# EAGLE design pic_board (EAGLE 6.1)
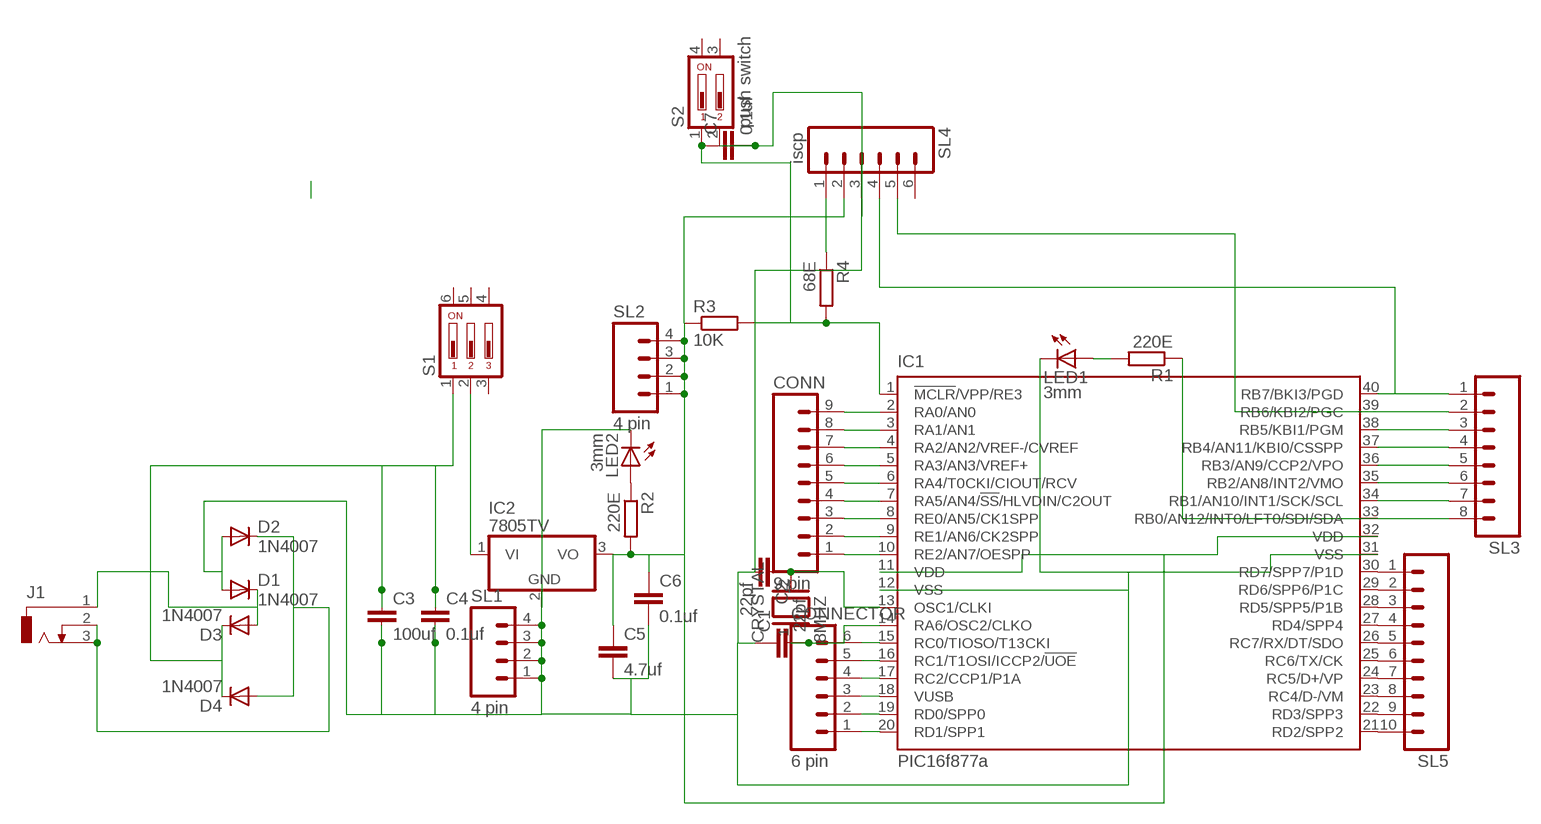
[diagram p0: schematic, sheet 1]

## Parts
C1  22pf  C2.5/2  [C2.5-2]
C2  22pf  C2.5/2  [C2.5-2]
C3  100uf  C5/7.2  [C5B7.2]
C4  0.1uf  C2,5-3  [C2.5-3]
C5  4.7uf  C5/7.2  [C5B7.2]
C6  0.1uf  C2.5/2  [C2.5-2]
C7  0.1uf  C2,5-3  [C2.5-3]
CONN  9 pin  M09  [09P]
CONNECTOR  6 pin  M06  [06P]
CRYSTAL  8MHZ  XTAL/S  [QS]
D1  1N4007  1N4004  [DO41-10]
D2  1N4007  1N4004  [DO41-10]
D3  1N4007  1N4004  [DO41-10]
D4  1N4007  1N4004  [DO41-10]
IC1  PIC16f877a  PIC18F4455_40  [DIL40]
IC2  7805TV  [TO220V]
J1  DCJ0303  [DCJ0303]
LED1  3mm  LED3MM  [LED3MM]
LED2  3mm  LED3MM  [LED3MM]
R1  220E  R-EU_0204/7  [0204/7]
R2  220E  R-EU_0204/7  [0204/7]
R3  10K  R-EU_0204/7  [0204/7]
R4  68E  R-EU_0204/7  [0204/7]
S1  DA03  [DA-03]
S2  push switch  DP02  [DP-02]
SL1  4 pin  M04  [04P]
SL2  4 pin  M04  [04P]
SL3  M08  [08P]
SL4  iscp  M06  [06P]
SL5  M10  [10P]

## Nets
N$1: C2.1 CRYSTAL.2 IC1.13(OSC1/CLKI)
N$2: C1.2 CRYSTAL.1 IC1.14(RA6/OSC2/CLKO)
N$3: LED1.A R1.2
N$4: CONN.1 IC1.10(RE2/AN7/OESPP)
N$5: CONN.2 IC1.9(RE1/AN6/CK2SPP)
N$6: CONN.3 IC1.8(RE0/AN5/CK1SPP)
N$7: CONN.4 IC1.7(RA5/AN4/!SS!/HLVDIN/C2OUT)
N$8: CONN.5 IC1.6(RA4/T0CKI/CIOUT/RCV)
N$9: CONN.6 IC1.5(RA3/AN3/VREF+)
N$10: CONN.7 IC1.4(RA2/AN2/VREF-/CVREF)
N$11: CONN.8 IC1.3(RA1/AN1)
N$12: CONN.9 IC1.2(RA0/AN0)
N$13: CONNECTOR.1 IC1.20(RD1/SPP1)
N$14: CONNECTOR.2 IC1.19(RD0/SPP0)
N$15: CONNECTOR.3 IC1.18(VUSB)
N$16: CONNECTOR.4 IC1.17(RC2/CCP1/P1A)
N$17: CONNECTOR.5 IC1.16(RC1/T1OSI/ICCP2/!UOE)
N$18: CONNECTOR.6 IC1.15(RC0/TIOSO/T13CKI)
N$19: IC1.40(RB7/BKI3/PGD) SL3.1 SL4.4
N$20: IC1.39(RB6/KBI2/PGC) SL3.2 SL4.5
N$21: IC1.38(RB5/KBI1/PGM) SL3.3
N$22: IC1.37(RB4/AN11/KBI0/CSSPP) SL3.4
N$23: IC1.36(RB3/AN9/CCP2/VPO) SL3.5
N$24: IC1.35(RB2/AN8/INT2/VMO) SL3.6
N$25: IC1.34(RB1/AN10/INT1/SCK/SCL) SL3.7
N$26: IC1.30(RD7/SPP7/P1D) SL5.1
N$27: IC1.29(RD6/SPP6/P1C) SL5.2
N$28: IC1.28(RD5/SPP5/P1B) SL5.3
N$29: IC1.33(RB0/AN12/INT0/LFT0/SDI/SDA) R1.1 SL3.8
N$30: C3.1 C4.1 D3.C D4.C S1.1
N$31: D2.C D4.A J1.2 J1.3
N$32: D1.C D3.A J1.1
N$33: C5.1 C6.1 IC1.11(VDD) IC1.32(VDD) IC2.3(VO) R2.2 R3.1 SL2.1 SL2.2 SL2.3 SL2.4 SL4.2
N$34: LED2.A R2.1
N$35: C1.1 C2.2 C3.2 C4.2 C5.2 C6.2 C7.2 D1.A D2.A IC1.12(VSS) IC1.31(VSS) IC2.2(GND) LED1.K(C) LED2.K(C) S2.2 SL1.1 SL1.2 SL1.3 SL1.4 SL4.3
N$36: IC1.27(RD4/SPP4) SL5.4
N$37: IC1.26(RC7/RX/DT/SDO) SL5.5
N$38: IC1.25(RC6/TX/CK) SL5.6
N$39: C7.1 IC1.1(!MCLR!/VPP/RE3) R3.2 R4.2 S2.1
N$40: IC1.24(RC5/D+/VP) SL5.7
N$41: IC1.23(RC4/D-/VM) SL5.8
N$42: IC1.22(RD3/SPP3) SL5.9
N$43: IC1.21(RD2/SPP2) SL5.10
N$44: R4.1 SL4.1
N$45: IC2.1(VI) S1.2
Unconnected: S1.3 S1.4 S1.5 S1.6 S2.3 S2.4 SL4.6

## Library data of the parts
C1-C7 = capacitor-wima:C: CAPACITOR naming: grid - package width
CONN = con-amp-quick:M09: AMP QUICK CONNECTOR; OC_FARNELL: unknown; OC_NEWARK: unknown
CONNECTOR SL4 = con-amp-quick:M06: AMP QUICK CONNECTOR; OC_FARNELL: unknown; OC_NEWARK: unknown
CRYSTAL = special:XTAL/S: CRYSTAL
D1-D4 = diode:1N4004: DIODE general purpose rectifier, 1 A
IC1 = microchip:PIC18F4*_40: USB Microcontrollers with nanoWatt Technology High-Performance, Enhanced Flash, 28/40/44-Pin, Source: http://ww1.microchip.com/downloads/en/devicedoc/39632c.pdf; MF: MICROCHIP; MPN: PIC18F4455-I/P; OC_FARNELL: 9321314; OC_NEWARK: 05K2028
IC2 = linear:78*: Positive VOLTAGE REGULATOR Source: http://cache.national.com/ds/LM/LM78L05.pdf http://www.fairchildsemi.com/ds/LM/LM7805.pdf
J1 = con-jack:DCJ0303: DC POWER JACK Source: DCJ0303.pdf; OC_FARNELL: unknown; OC_NEWARK: unknown
LED1 LED2 = led:LED: LED OSRAM: - CHIPLED LG R971, LG N971, LY N971, LG Q971, LY Q971, LO R971, LY R971 LH N974, LH R974 LS Q976, LO Q976, LY Q976 LO Q996 - Hyper CHIPLED LW Q18S LB Q993, LB Q99A, LB R99A - SideLED LS A670, LO A670, LY A670, LG A670, LP A670 LB A673, LV A673, LT A673, LW A673 LH A674 LY A675 LS A676, LA A676, LO A676, LY A676, LW A676 LS A679, LY A679, LG A679 - Hyper Micro SIDELED® LS Y876, LA Y876, LO Y876, LY Y876 LT Y87S - SmartLED LW L88C, LW L88S LB L89C, LB L89S, LG L890 LS L89K, LO L89K, LY L89K LS L896, LA L896, LO L896, LY L896 - TOPLED LS T670, LO T670, LY T670, LG T670, LP T670 LSG T670, LSP T670, LSY T670, LOP T670, LYG T670 LG T671, LOG T671, LSG T671 LB T673, LV T673, LT T673, LW T673 LH T674 LS T676, LA T676, LO T676, LY T676, LB T676, LH T676, LSB T676, LW T676 LB T67C, LV T67C, LT T67C, LS T67K, LO T67K, LY T67K, LW E67C LS E67B, LA E67B, LO E67B, LY E67B, LB E67C, LV E67C, LT E67C LW T67C LS T679, LY T679, LG T679 LS T770, LO T770, LY T770, LG T770, LP T770 LB T773, LV T773, LT T773, LW T773 LH T774 LS E675, LA E675, LY E675, LS T675 LS T776, LA T776, LO T776, LY T776, LB T776 LHGB T686 LT T68C, LB T68C - Hyper Mini TOPLED® LB M676 - Mini TOPLED Santana® LG M470 LS M47K, LO M47K, LY M47K Source: http://www.osram.convergy.de LUXEON: - LUMILED® LXK2-PW12-R00, LXK2-PW12-S00, LXK2-PW14-U00, LXK2-PW14-V00 LXK2-PM12-R00, LXK2-PM12-S00, LXK2-PM14-U00 LXK2-PE12-Q00, LXK2-PE12-R00, LXK2-PE12-S00, LXK2-PE14-T00, LXK2-PE14-U00 LXK2-PB12-K00, LXK2-PB12-L00, LXK2-PB12-M00, LXK2-PB14-N00, LXK2-PB14-P00, LXK2-PB14-Q00 LXK2-PR12-L00, LXK2-PR12-M00, LXK2-PR14-Q00, LXK2-PR14-R00 LXK2-PD12-Q00, LXK2-PD12-R00, LXK2-PD12-S00 LXK2-PH12-R00, LXK2-PH12-S00 LXK2-PL12-P00, LXK2-PL12-Q00, LXK2-PL12-R00 Source: www.luxeon.com KINGBRIGHT: KA-3528ASYC Source: www.kingbright.com
R1-R4 = rcl:R-EU_: RESISTOR, European symbol
S1 = switch-dil:DA03: DIL/CODE SWITCH; MPN: MCDA03; OC_FARNELL: 1521999; OC_NEWARK: 74M2972
S2 = switch-dil:DP02: DIL/CODE SWITCH; MPN: MCDP02; OC_FARNELL: 1255233; OC_NEWARK: 26M1095
SL1 SL2 = con-amp-quick:M04: AMP QUICK CONNECTOR; OC_FARNELL: unknown; OC_NEWARK: unknown
SL3 = con-amp-quick:M08: AMP QUICK CONNECTOR; OC_FARNELL: unknown; OC_NEWARK: unknown
SL5 = con-amp-quick:M10: AMP QUICK CONNECTOR; OC_FARNELL: unknown; OC_NEWARK: unknown

## Board
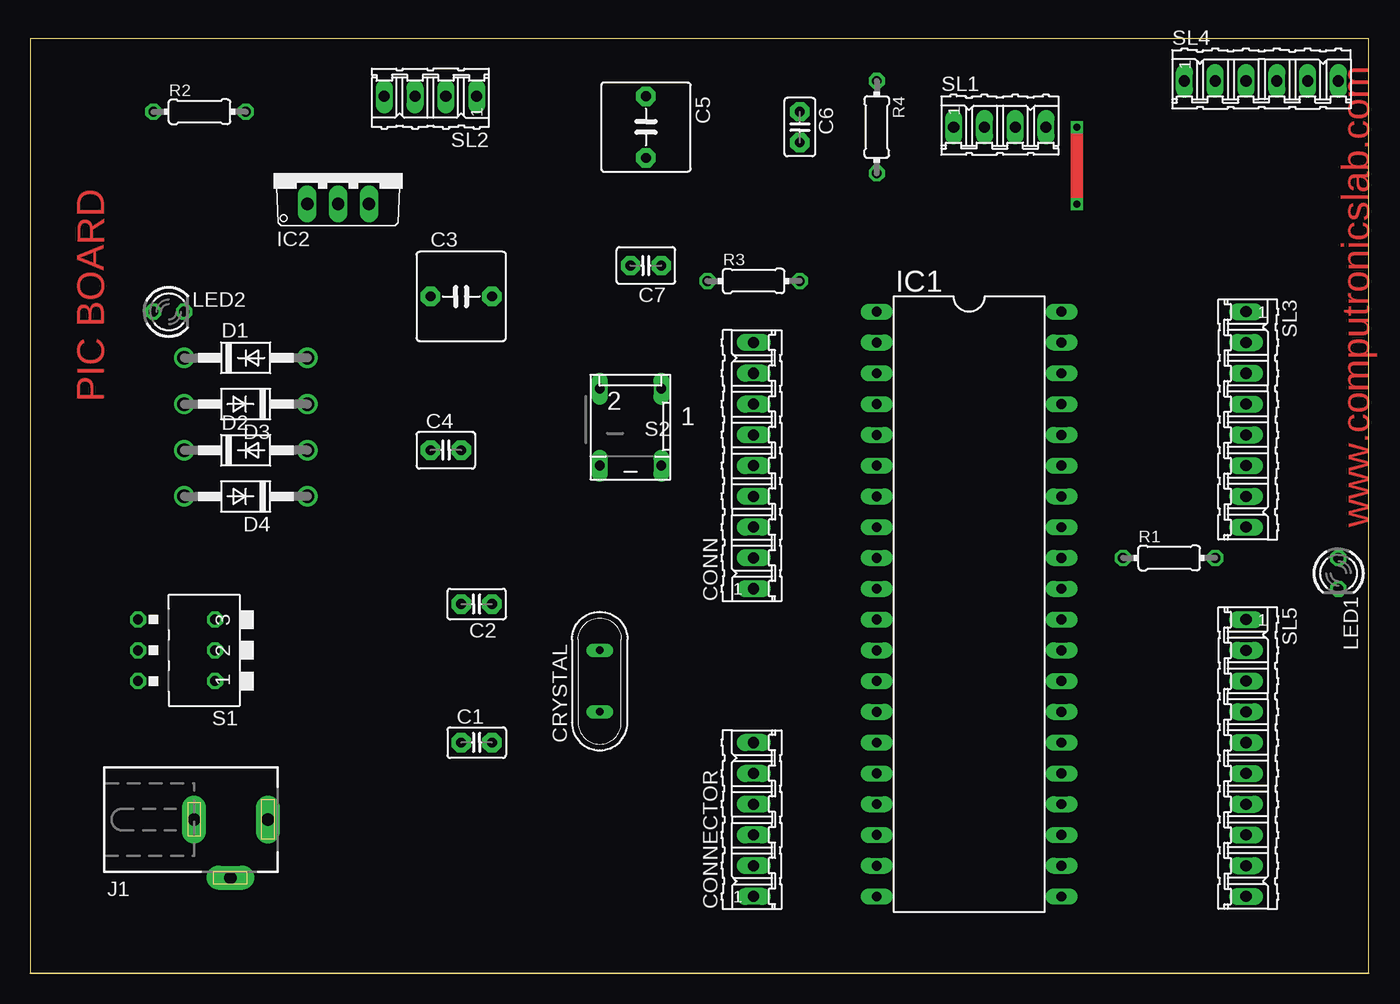
[diagram p1: board, top side]
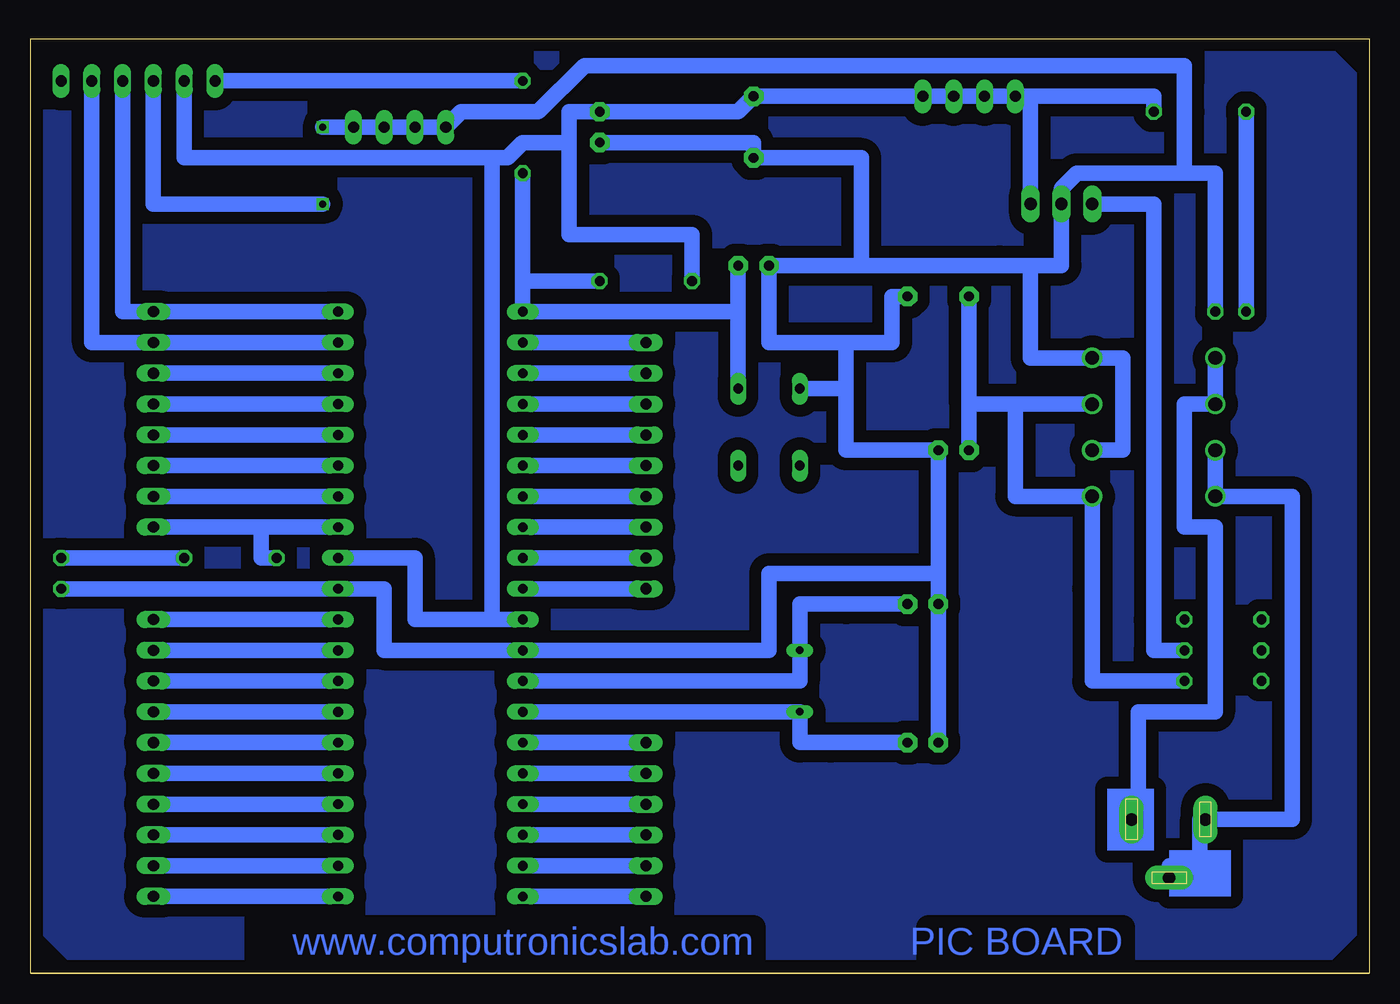
[diagram p2: board, bottom side, seen from below]

Size 110.47 x 77.14 mm. Coordinates in mm from the lower left corner, seen from the top.
Outline: 0,0 110.47,0 110.47,77.14 0,77.14 0,0
Copper layers (1*16): Top 0.035mm / dielectric 1.5mm / Bottom 0.035mm
Design rules: minimum track width 50mil, minimum drill 24mil, track to track 8mil, track to pad 8mil, pad to pad 8mil, via to via 8mil, smd to smd 8mil, copper to edge 40mil, drill to drill 8mil, minimum pad ring 10mil, minimum via ring 8mil, stop-mask expansion 4mil, vias tented up to drill 0mil, thermal gap 10mil

### Footprints (pad centres in the part's own frame; a part is rotated, then mirrored left to right if it is on the bottom)
C2.5-2 = drill 0.813 pad 1.6 octagon: 1 -1.27,0; 2 1.27,0
C5B7.2 = drill 0.813 pad 1.6 octagon: 1 -2.54,0; 2 2.54,0
C2.5-3 = drill 0.813 pad 1.6 octagon: 1 -1.27,0; 2 1.27,0
09P = drill 0.914 long: 1 -10.16,0; 2 -7.62,0; 3 -5.08,0; 4 -2.54,0; 5 0,0; 6 2.54,0; 7 5.08,0; 8 7.62,0; 9 10.16,0
06P = drill 0.914 long: 1 -6.35,0; 2 -3.81,0; 3 -1.27,0; 4 1.27,0; 5 3.81,0; 6 6.35,0
QS = drill 0.61 long: 1 -2.54,0; 2 2.54,0
DO41-10 = drill 1.118: A 5.08,0; C -5.08,0
DIL40 = drill 0.813 long: 1 -24.13,-7.62; 2 -21.59,-7.62; 3 -19.05,-7.62; 4 -16.51,-7.62; 5 -13.97,-7.62; 6 -11.43,-7.62; 7 -8.89,-7.62; 8 -6.35,-7.62; 9 -3.81,-7.62; 10 -1.27,-7.62; 11 1.27,-7.62; 12 3.81,-7.62; 13 6.35,-7.62; 14 8.89,-7.62; 15 11.43,-7.62; 16 13.97,-7.62; 17 16.51,-7.62; 18 19.05,-7.62; 19 21.59,-7.62; 20 24.13,-7.62; 21 24.13,7.62; 22 21.59,7.62; 23 19.05,7.62; 24 16.51,7.62; 25 13.97,7.62; 26 11.43,7.62; 27 8.89,7.62; 28 6.35,7.62; 29 3.81,7.62; 30 1.27,7.62; 31 -1.27,7.62; 32 -3.81,7.62; 33 -6.35,7.62; 34 -8.89,7.62; 35 -11.43,7.62; 36 -13.97,7.62; 37 -16.51,7.62; 38 -19.05,7.62; 39 -21.59,7.62; 40 -24.13,7.62
TO220V = drill 1.016 long: 1 -2.54,-2.54; 2 0,-2.54; 3 2.54,-2.54
DCJ0303 = drill 1 pad 2 long: 1 0,3.1; 2 4.8,0; 3 0,-3
LED3MM = drill 0.813 octagon: A -1.27,0; K 1.27,0
0204/7 = drill 0.813 octagon: 1 -3.81,0; 2 3.81,0
DA-03 = drill 0.813 octagon: 1 -2.54,-5.08; 2 0,-5.08; 3 2.54,-5.08; 4 2.54,1.27; 5 0,1.27; 6 -2.54,1.27
DP-02 = drill 0.813 long: 1 -2.54,-2.54; 2 2.54,-2.54; 3 2.54,3.81; 4 -2.54,3.81
04P = drill 0.914 long: 1 -3.81,0; 2 -1.27,0; 3 1.27,0; 4 3.81,0
08P = drill 0.914 long: 1 -8.89,0; 2 -6.35,0; 3 -3.81,0; 4 -1.27,0; 5 1.27,0; 6 3.81,0; 7 6.35,0; 8 8.89,0
10P = drill 0.914 long: 1 -11.43,0; 2 -8.89,0; 3 -6.35,0; 4 -3.81,0; 5 -1.27,0; 6 1.27,0; 7 3.81,0; 8 6.35,0; 9 8.89,0; 10 11.43,0

### Placement (x,y rotation side)
C1  36.83,19.05 0 top
C2  36.83,30.48 180 top
C3  35.56,55.88 0 top
C4  34.29,43.18 0 top
C5  50.8,69.85 270 top
C6  63.5,69.85 270 top
C7  50.8,58.42 180 top
CONN  59.69,41.91 90 top
CONNECTOR  59.69,12.7 90 top
CRYSTAL  46.99,24.13 90 top
D1  17.78,50.8 0 top
D2  17.78,43.18 0 top
D3  17.78,46.99 180 top
D4  17.78,39.37 180 top
IC1  77.47,30.48 270 top
IC2  25.4,66.04 0 top
J1  16.51,12.7 270 top
LED1  107.95,33.02 270 top
LED2  11.43,54.61 0 top
R1  93.98,34.29 0 top
R2  13.97,71.12 0 top
R3  59.69,57.15 0 top
R4  69.85,69.85 270 top
S1  10.16,26.67 90 top
S2  49.53,45.72 180 top
SL1  80.01,69.85 0 top
SL2  33.02,72.39 180 top
SL3  100.33,45.72 270 top
SL4  101.6,73.66 0 top
SL5  100.33,17.78 270 top

### Tracks (layer width: path | path; a pad name or v marks a point on that pad's centre or on a via)
N$1
  Bottom 1.27: C2.1 43.18,30.48 46.99,30.48 CRYSTAL.2 46.99,24.13 IC1.13
N$2
  Bottom 1.27: C1.2 44.45,19.05 46.99,19.05 CRYSTAL.1 IC1.14
N$3
  Bottom 1.27: LED1.A R1.2
N$4
  Bottom 1.27: CONN.1 IC1.10
N$5
  Bottom 1.27: CONN.2 IC1.9
N$6
  Bottom 1.27: CONN.3 IC1.8
N$7
  Bottom 1.27: CONN.4 IC1.7
N$8
  Bottom 1.27: CONN.5 IC1.6
N$9
  Bottom 1.27: CONN.6 IC1.5
N$10
  Bottom 1.27: CONN.7 IC1.4
N$11
  Bottom 1.27: CONN.8 IC1.3
N$12
  Bottom 1.27: CONN.9 IC1.2
N$13
  Bottom 1.27: CONNECTOR.1 IC1.20
N$14
  Bottom 1.27: CONNECTOR.2 IC1.19
N$15
  Bottom 1.27: CONNECTOR.3 IC1.18
N$16
  Bottom 1.27: CONNECTOR.4 IC1.17
N$17
  Bottom 1.27: CONNECTOR.5 IC1.16
N$18
  Bottom 1.27: CONNECTOR.6 IC1.15
N$19
  Bottom 1.27: IC1.40 SL3.1 102.87,54.61 SL4.4
N$20
  Bottom 1.27: IC1.39 SL3.2 105.41,52.07 SL4.5
N$21
  Bottom 1.27: SL3.3 IC1.38
N$22
  Bottom 1.27: SL3.4 IC1.37
N$23
  Bottom 1.27: SL3.5 IC1.36
N$24
  Bottom 1.27: SL3.6 IC1.35
N$25
  Bottom 1.27: SL3.7 IC1.34
N$26
  Bottom 1.27: SL5.1 IC1.30
N$27
  Bottom 1.27: SL5.2 IC1.29
N$28
  Bottom 1.27: SL5.3 IC1.28
N$29
  Bottom 1.27: 87.63,36.83 91.44,36.83 91.44,34.29 R1.1 | IC1.33 87.63,36.83 | 87.63,36.83 SL3.8
N$30
  Bottom 1.27: S1.1 22.86,24.13 22.86,31.75 D4.C 29.21,39.37 29.21,45.72 29.21,46.99 | 29.21,46.99 33.02,46.99 | 33.02,46.99 C4.1 | D3.C 29.21,46.99 | 33.02,46.99 C3.1 | 29.21,46.99 33.02,46.99
N$31
  Bottom 1.27: D2.C D4.A 6.35,39.37 6.35,33.02 6.35,12.7 12.7,12.7 J1.3 13.97,12.7 13.97,8.89 16.51,8.89 J1.2
N$32
  Bottom 1.27: D1.C D3.A 15.24,46.99 15.24,39.37 15.24,36.83 12.7,36.83 12.7,24.13 12.7,21.59 15.24,21.59 19.05,21.59 19.05,12.7 J1.1
N$33
  Bottom 1.27: R2.2 17.78,72.39 27.94,72.39 | 27.94,72.39 SL2.4 SL2.3 SL2.2 SL2.1 C5.1 52.07,71.12 C6.1 66.04,71.12 66.04,68.58 | 27.94,72.39 IC2.3 | 72.39,29.21 78.74,29.21 78.74,31.75 78.74,33.02 78.74,34.29 83.82,34.29 IC1.32 | 72.39,29.21 IC1.11 | R3.1 55.88,60.96 66.04,60.96 66.04,67.31 66.04,68.58 | SL4.2 97.79,67.31 72.39,67.31 | 72.39,67.31 71.12,67.31 69.85,68.58 66.04,68.58 | 72.39,67.31 72.39,29.21
N$34
  Bottom 1.27: R2.1 LED2.A
N$35  (via drill 0.6)
  Top 1.016: v86.36,69.85 v86.36,63.5
  Bottom 1.27: LED2.K 12.7,66.04 15.24,66.04 | 15.24,66.04 24.13,66.04 25.4,64.77 IC2.2 25.4,58.42 30.48,58.42 | 15.24,66.04 15.24,71.12 15.24,73.66 15.24,74.93 19.05,74.93 64.77,74.93 68.58,71.12 74.93,71.12 SL1.1 SL1.2 SL1.3 SL1.4 v86.36,69.85 | LED1.K IC1.31 83.82,31.75 81.28,31.75 81.28,26.67 78.74,26.67 IC1.12 49.53,26.67 49.53,33.02 43.18,33.02 35.56,33.02 | C6.2 50.8,68.58 C5.2 41.91,67.31 41.91,64.77 41.91,58.42 | C1.1 C2.2 35.56,33.02 | D2.A 20.32,43.18 20.32,45.72 20.32,50.8 D1.A 27.94,50.8 27.94,58.42 30.48,58.42 | 43.18,52.07 39.37,52.07 39.37,55.88 C3.2 | 43.18,52.07 43.18,48.26 | 43.18,48.26 S2.2 | 43.18,48.26 43.18,50.8 43.18,48.26 | 43.18,48.26 43.18,44.45 43.18,43.18 C4.2 35.56,33.02 | 43.18,52.07 49.53,52.07 C7.2 41.91,58.42 | 41.91,58.42 30.48,58.42 | v86.36,63.5 100.33,63.5 SL4.3
N$36
  Bottom 1.27: SL5.4 IC1.27
N$37
  Bottom 1.27: SL5.5 IC1.26
N$38
  Bottom 1.27: SL5.6 IC1.25
N$39
  Bottom 1.27: C7.1 52.07,54.61 | 52.07,54.61 S2.1 | 67.31,57.15 69.85,57.15 | 69.85,57.15 IC1.1 52.07,54.61 | R3.2 67.31,57.15 | 69.85,57.15 R4.2 | 67.31,57.15 69.85,57.15
N$40
  Bottom 1.27: SL5.7 IC1.24
N$41
  Bottom 1.27: SL5.8 IC1.23
N$42
  Bottom 1.27: SL5.9 IC1.22
N$43
  Bottom 1.27: SL5.10 IC1.21
N$44
  Bottom 1.27: SL4.1 R4.1
N$45
  Bottom 1.27: S1.2 17.78,26.67 17.78,29.21 17.78,63.5 IC2.1
N$46
  pour Bottom (isolate 1.016, no thermals): 6.35,0 5.08,0 0,5.08 0,72.39 3.81,76.2 106.68,76.2 110.49,72.39 110.49,5.08 105.41,0
(copper drawn outside any net)
  shapes: Bottom area x2

### Text on the board
Top: PIC BOARD | www.computronicslab.com
Bottom: PIC BOARD | www.computronicslab.com